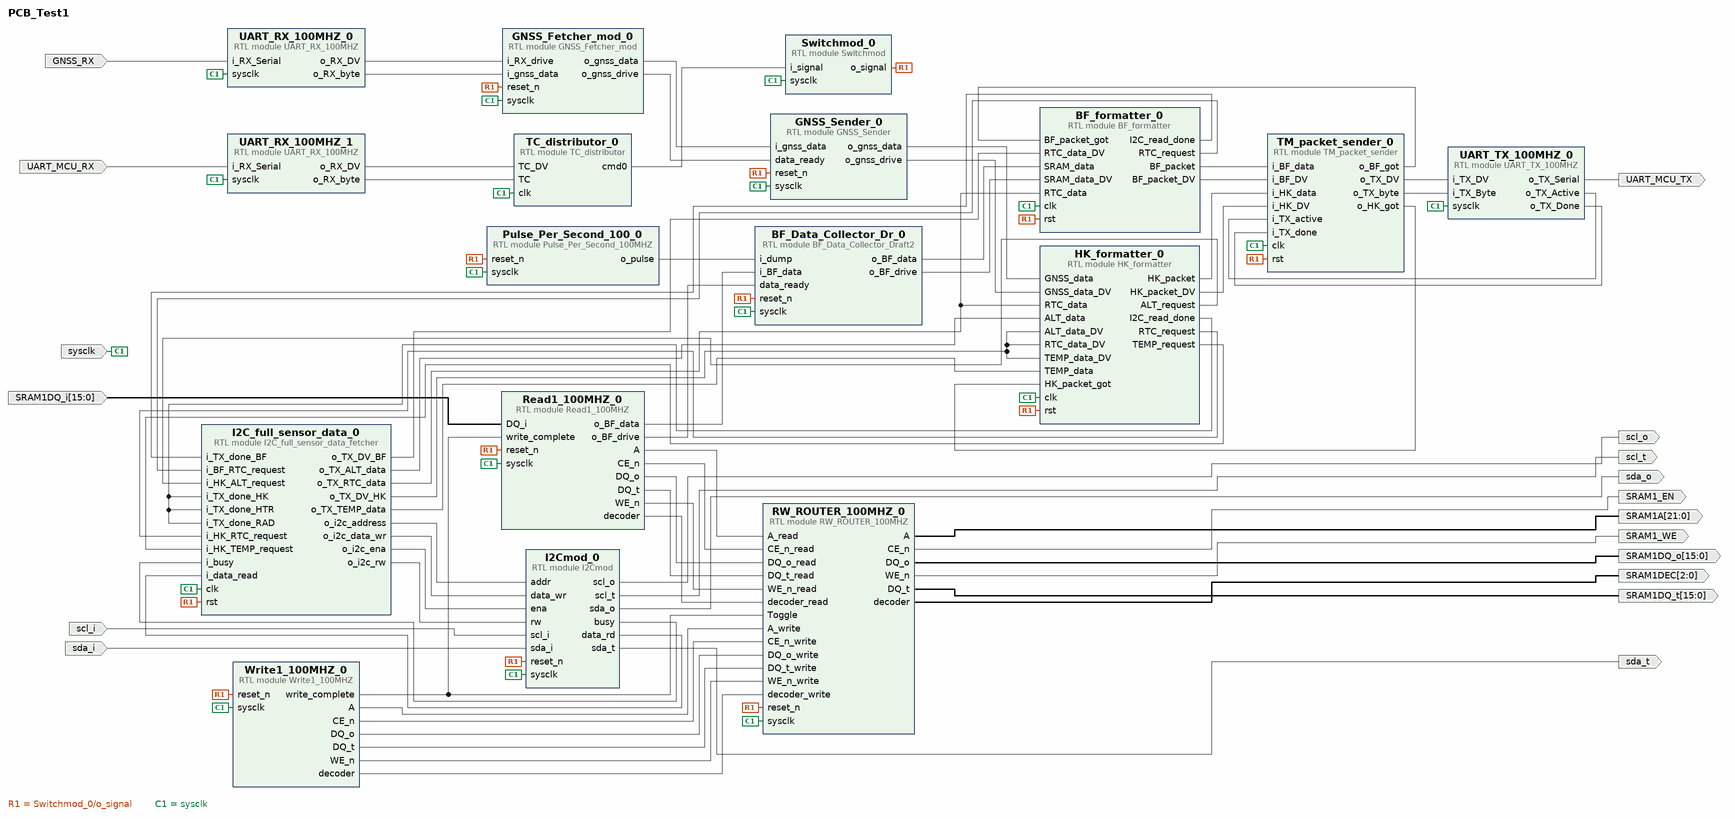
[diagram p0: block diagram of the top level]
# Vivado block design PCB_Test1, xc7a100tcsg324-2, Vivado 2024.2
create_bd_design PCB_Test1

create_bd_port -dir I sysclk
create_bd_port -dir I -from 15 -to 0 SRAM1DQ_i
create_bd_port -dir O -from 2 -to 0 SRAM1DEC
create_bd_port -dir O -from 15 -to 0 SRAM1DQ_t
create_bd_port -dir O -from 15 -to 0 SRAM1DQ_o
create_bd_port -dir O SRAM1_WE
create_bd_port -dir O SRAM1_EN
create_bd_port -dir O -from 21 -to 0 SRAM1A
create_bd_port -dir I sda_i
create_bd_port -dir I scl_i
create_bd_port -dir O sda_o
create_bd_port -dir O sda_t
create_bd_port -dir O scl_o
create_bd_port -dir O scl_t
create_bd_port -dir I GNSS_RX
create_bd_port -dir O UART_MCU_TX
create_bd_port -dir I UART_MCU_RX

create_bd_cell -type module -reference BF_Data_Collector_Draft2 BF_Data_Collector_Dr_0
create_bd_cell -type module -reference BF_formatter BF_formatter_0
set_property -dict {CONFIG.Clockfrequency 100000000} [get_bd_cells BF_formatter_0]
create_bd_cell -type module -reference GNSS_Fetcher_mod GNSS_Fetcher_mod_0
create_bd_cell -type module -reference GNSS_Sender GNSS_Sender_0
create_bd_cell -type module -reference HK_formatter HK_formatter_0
set_property -dict {CONFIG.Clockfrequency 100000000} [get_bd_cells HK_formatter_0]
create_bd_cell -type module -reference I2C_full_sensor_data_fetcher I2C_full_sensor_data_0
set_property -dict {CONFIG.Clockfrequency 100000000} [get_bd_cells I2C_full_sensor_data_0]
create_bd_cell -type module -reference I2Cmod I2Cmod_0
set_property -dict {CONFIG.Sys_Clockfrequency 100000000} [get_bd_cells I2Cmod_0]
create_bd_cell -type module -reference Pulse_Per_Second_100MHZ Pulse_Per_Second_100_0
create_bd_cell -type module -reference Read1_100MHZ Read1_100MHZ_0
create_bd_cell -type module -reference RW_ROUTER_100MHZ RW_ROUTER_100MHZ_0
create_bd_cell -type module -reference Switchmod Switchmod_0
create_bd_cell -type module -reference TM_packet_sender TM_packet_sender_0
set_property -dict {CONFIG.Clockfrequency 100000000} [get_bd_cells TM_packet_sender_0]
create_bd_cell -type module -reference UART_RX_100MHZ UART_RX_100MHZ_0
set_property -dict {CONFIG.Baud_Rate 9600} [get_bd_cells UART_RX_100MHZ_0]
create_bd_cell -type module -reference UART_TX_100MHZ UART_TX_100MHZ_0
create_bd_cell -type module -reference Write1_100MHZ Write1_100MHZ_0
create_bd_cell -type module -reference UART_RX_100MHZ UART_RX_100MHZ_1
create_bd_cell -type module -reference TC_distributor TC_distributor_0
set_property -dict {CONFIG.Clockfrequency 100000000} [get_bd_cells TC_distributor_0]

# ---- connections ----

connect_bd_net [get_bd_pins BF_Data_Collector_Dr_0/o_BF_data] [get_bd_pins BF_formatter_0/SRAM_data]
connect_bd_net [get_bd_pins BF_Data_Collector_Dr_0/o_BF_drive] [get_bd_pins BF_formatter_0/SRAM_data_DV]
connect_bd_net [get_bd_pins BF_formatter_0/BF_packet] [get_bd_pins TM_packet_sender_0/i_BF_data]
connect_bd_net [get_bd_pins BF_formatter_0/BF_packet_DV] [get_bd_pins TM_packet_sender_0/i_BF_DV]
connect_bd_net [get_bd_pins BF_formatter_0/I2C_read_done] [get_bd_pins I2C_full_sensor_data_0/i_TX_done_BF]
connect_bd_net [get_bd_pins BF_formatter_0/RTC_request] [get_bd_pins I2C_full_sensor_data_0/i_BF_RTC_request]
connect_bd_net -net DQ_i_0_1 [get_bd_ports SRAM1DQ_i] [get_bd_pins Read1_100MHZ_0/DQ_i]
connect_bd_net [get_bd_pins GNSS_Fetcher_mod_0/o_gnss_data] [get_bd_pins GNSS_Sender_0/i_gnss_data]
connect_bd_net [get_bd_pins GNSS_Fetcher_mod_0/o_gnss_drive] [get_bd_pins GNSS_Sender_0/data_ready]
connect_bd_net [get_bd_pins GNSS_Sender_0/o_gnss_data] [get_bd_pins HK_formatter_0/GNSS_data]
connect_bd_net [get_bd_pins GNSS_Sender_0/o_gnss_drive] [get_bd_pins HK_formatter_0/GNSS_data_DV]
connect_bd_net [get_bd_pins HK_formatter_0/ALT_request] [get_bd_pins I2C_full_sensor_data_0/i_HK_ALT_request]
connect_bd_net [get_bd_pins HK_formatter_0/HK_packet] [get_bd_pins TM_packet_sender_0/i_HK_data]
connect_bd_net [get_bd_pins HK_formatter_0/HK_packet_DV] [get_bd_pins TM_packet_sender_0/i_HK_DV]
connect_bd_net [get_bd_pins HK_formatter_0/I2C_read_done] \
  [get_bd_pins I2C_full_sensor_data_0/i_TX_done_HK] [get_bd_pins I2C_full_sensor_data_0/i_TX_done_RAD] \
  [get_bd_pins I2C_full_sensor_data_0/i_TX_done_HTR]
connect_bd_net [get_bd_pins HK_formatter_0/RTC_request] [get_bd_pins I2C_full_sensor_data_0/i_HK_RTC_request]
connect_bd_net [get_bd_pins HK_formatter_0/TEMP_request] [get_bd_pins I2C_full_sensor_data_0/i_HK_TEMP_request]
connect_bd_net [get_bd_pins I2C_full_sensor_data_0/o_TX_ALT_data] [get_bd_pins HK_formatter_0/ALT_data]
connect_bd_net [get_bd_pins I2C_full_sensor_data_0/o_TX_DV_BF] [get_bd_pins BF_formatter_0/RTC_data_DV]
connect_bd_net [get_bd_pins I2C_full_sensor_data_0/o_TX_DV_HK] \
  [get_bd_pins HK_formatter_0/RTC_data_DV] [get_bd_pins HK_formatter_0/ALT_data_DV] [get_bd_pins HK_formatter_0/TEMP_data_DV]
connect_bd_net [get_bd_pins I2C_full_sensor_data_0/o_TX_RTC_data] [get_bd_pins BF_formatter_0/RTC_data] [get_bd_pins HK_formatter_0/RTC_data]
connect_bd_net [get_bd_pins I2C_full_sensor_data_0/o_TX_TEMP_data] [get_bd_pins HK_formatter_0/TEMP_data]
connect_bd_net [get_bd_pins I2C_full_sensor_data_0/o_i2c_address] [get_bd_pins I2Cmod_0/addr]
connect_bd_net [get_bd_pins I2C_full_sensor_data_0/o_i2c_data_wr] [get_bd_pins I2Cmod_0/data_wr]
connect_bd_net [get_bd_pins I2C_full_sensor_data_0/o_i2c_ena] [get_bd_pins I2Cmod_0/ena]
connect_bd_net [get_bd_pins I2C_full_sensor_data_0/o_i2c_rw] [get_bd_pins I2Cmod_0/rw]
connect_bd_net [get_bd_pins I2Cmod_0/busy] [get_bd_pins I2C_full_sensor_data_0/i_busy]
connect_bd_net [get_bd_pins I2Cmod_0/data_rd] [get_bd_pins I2C_full_sensor_data_0/i_data_read]
connect_bd_net [get_bd_pins I2Cmod_0/scl_o] [get_bd_ports scl_o]
connect_bd_net [get_bd_pins I2Cmod_0/scl_t] [get_bd_ports scl_t]
connect_bd_net [get_bd_pins I2Cmod_0/sda_o] [get_bd_ports sda_o]
connect_bd_net [get_bd_pins I2Cmod_0/sda_t] [get_bd_ports sda_t]
connect_bd_net [get_bd_pins Pulse_Per_Second_100_0/o_pulse] [get_bd_pins BF_Data_Collector_Dr_0/i_dump]
connect_bd_net [get_bd_pins RW_ROUTER_100MHZ_0/A] [get_bd_ports SRAM1A]
connect_bd_net [get_bd_pins RW_ROUTER_100MHZ_0/CE_n] [get_bd_ports SRAM1_EN]
connect_bd_net [get_bd_pins RW_ROUTER_100MHZ_0/DQ_o] [get_bd_ports SRAM1DQ_o]
connect_bd_net [get_bd_pins RW_ROUTER_100MHZ_0/DQ_t] [get_bd_ports SRAM1DQ_t]
connect_bd_net [get_bd_pins RW_ROUTER_100MHZ_0/WE_n] [get_bd_ports SRAM1_WE]
connect_bd_net [get_bd_pins RW_ROUTER_100MHZ_0/decoder] [get_bd_ports SRAM1DEC]
connect_bd_net [get_bd_pins Read1_100MHZ_0/A] [get_bd_pins RW_ROUTER_100MHZ_0/A_read]
connect_bd_net [get_bd_pins Read1_100MHZ_0/CE_n] [get_bd_pins RW_ROUTER_100MHZ_0/CE_n_read]
connect_bd_net [get_bd_pins Read1_100MHZ_0/DQ_o] [get_bd_pins RW_ROUTER_100MHZ_0/DQ_o_read]
connect_bd_net [get_bd_pins Read1_100MHZ_0/DQ_t] [get_bd_pins RW_ROUTER_100MHZ_0/DQ_t_read]
connect_bd_net [get_bd_pins Read1_100MHZ_0/WE_n] [get_bd_pins RW_ROUTER_100MHZ_0/WE_n_read]
connect_bd_net [get_bd_pins Read1_100MHZ_0/decoder] [get_bd_pins RW_ROUTER_100MHZ_0/decoder_read]
connect_bd_net [get_bd_pins Read1_100MHZ_0/o_BF_data] [get_bd_pins BF_Data_Collector_Dr_0/i_BF_data]
connect_bd_net [get_bd_pins Read1_100MHZ_0/o_BF_drive] [get_bd_pins BF_Data_Collector_Dr_0/data_ready]
connect_bd_net [get_bd_pins Switchmod_0/o_signal] \
  [get_bd_pins RW_ROUTER_100MHZ_0/reset_n] [get_bd_pins Read1_100MHZ_0/reset_n] [get_bd_pins Write1_100MHZ_0/reset_n] \
  [get_bd_pins BF_Data_Collector_Dr_0/reset_n] [get_bd_pins Pulse_Per_Second_100_0/reset_n] [get_bd_pins BF_formatter_0/rst] \
  [get_bd_pins I2Cmod_0/reset_n] [get_bd_pins I2C_full_sensor_data_0/rst] [get_bd_pins GNSS_Fetcher_mod_0/reset_n] \
  [get_bd_pins GNSS_Sender_0/reset_n] [get_bd_pins HK_formatter_0/rst] [get_bd_pins TM_packet_sender_0/rst]
connect_bd_net [get_bd_pins TC_distributor_0/cmd0] [get_bd_pins Switchmod_0/i_signal]
connect_bd_net [get_bd_pins TM_packet_sender_0/o_BF_got] [get_bd_pins BF_formatter_0/BF_packet_got]
connect_bd_net [get_bd_pins TM_packet_sender_0/o_HK_got] [get_bd_pins HK_formatter_0/HK_packet_got]
connect_bd_net [get_bd_pins TM_packet_sender_0/o_TX_DV] [get_bd_pins UART_TX_100MHZ_0/i_TX_DV]
connect_bd_net [get_bd_pins TM_packet_sender_0/o_TX_byte] [get_bd_pins UART_TX_100MHZ_0/i_TX_Byte]
connect_bd_net [get_bd_pins UART_RX_100MHZ_0/o_RX_DV] [get_bd_pins GNSS_Fetcher_mod_0/i_RX_drive]
connect_bd_net [get_bd_pins UART_RX_100MHZ_0/o_RX_byte] [get_bd_pins GNSS_Fetcher_mod_0/i_gnss_data]
connect_bd_net [get_bd_pins UART_RX_100MHZ_1/o_RX_DV] [get_bd_pins TC_distributor_0/TC_DV]
connect_bd_net [get_bd_pins UART_RX_100MHZ_1/o_RX_byte] [get_bd_pins TC_distributor_0/TC]
connect_bd_net [get_bd_pins UART_TX_100MHZ_0/o_TX_Active] [get_bd_pins TM_packet_sender_0/i_TX_active]
connect_bd_net [get_bd_pins UART_TX_100MHZ_0/o_TX_Done] [get_bd_pins TM_packet_sender_0/i_TX_done]
connect_bd_net [get_bd_pins UART_TX_100MHZ_0/o_TX_Serial] [get_bd_ports UART_MCU_TX]
connect_bd_net [get_bd_pins Write1_100MHZ_0/A] [get_bd_pins RW_ROUTER_100MHZ_0/A_write]
connect_bd_net [get_bd_pins Write1_100MHZ_0/CE_n] [get_bd_pins RW_ROUTER_100MHZ_0/CE_n_write]
connect_bd_net [get_bd_pins Write1_100MHZ_0/DQ_o] [get_bd_pins RW_ROUTER_100MHZ_0/DQ_o_write]
connect_bd_net [get_bd_pins Write1_100MHZ_0/DQ_t] [get_bd_pins RW_ROUTER_100MHZ_0/DQ_t_write]
connect_bd_net [get_bd_pins Write1_100MHZ_0/WE_n] [get_bd_pins RW_ROUTER_100MHZ_0/WE_n_write]
connect_bd_net [get_bd_pins Write1_100MHZ_0/decoder] [get_bd_pins RW_ROUTER_100MHZ_0/decoder_write]
connect_bd_net [get_bd_pins Write1_100MHZ_0/write_complete] [get_bd_pins Read1_100MHZ_0/write_complete] [get_bd_pins RW_ROUTER_100MHZ_0/Toggle]
connect_bd_net -net i_RX_Serial_0_1 [get_bd_ports GNSS_RX] [get_bd_pins UART_RX_100MHZ_0/i_RX_Serial]
connect_bd_net -net i_RX_Serial_0_2 [get_bd_ports UART_MCU_RX] [get_bd_pins UART_RX_100MHZ_1/i_RX_Serial]
connect_bd_net -net scl_i_0_1 [get_bd_ports scl_i] [get_bd_pins I2Cmod_0/scl_i]
connect_bd_net -net sda_i_0_1 [get_bd_ports sda_i] [get_bd_pins I2Cmod_0/sda_i]
connect_bd_net -net sysclk_0_1 [get_bd_ports sysclk] \
  [get_bd_pins RW_ROUTER_100MHZ_0/sysclk] [get_bd_pins Read1_100MHZ_0/sysclk] [get_bd_pins Switchmod_0/sysclk] \
  [get_bd_pins Write1_100MHZ_0/sysclk] [get_bd_pins BF_Data_Collector_Dr_0/sysclk] \
  [get_bd_pins Pulse_Per_Second_100_0/sysclk] [get_bd_pins BF_formatter_0/clk] [get_bd_pins I2Cmod_0/sysclk] \
  [get_bd_pins I2C_full_sensor_data_0/clk] [get_bd_pins UART_RX_100MHZ_0/sysclk] [get_bd_pins GNSS_Fetcher_mod_0/sysclk] \
  [get_bd_pins GNSS_Sender_0/sysclk] [get_bd_pins HK_formatter_0/clk] [get_bd_pins UART_TX_100MHZ_0/sysclk] \
  [get_bd_pins TM_packet_sender_0/clk] [get_bd_pins UART_RX_100MHZ_1/sysclk] [get_bd_pins TC_distributor_0/clk]

validate_bd_design
save_bd_design
